# EAGLE design TeamB_BoatAlert (EAGLE 7.4.0)
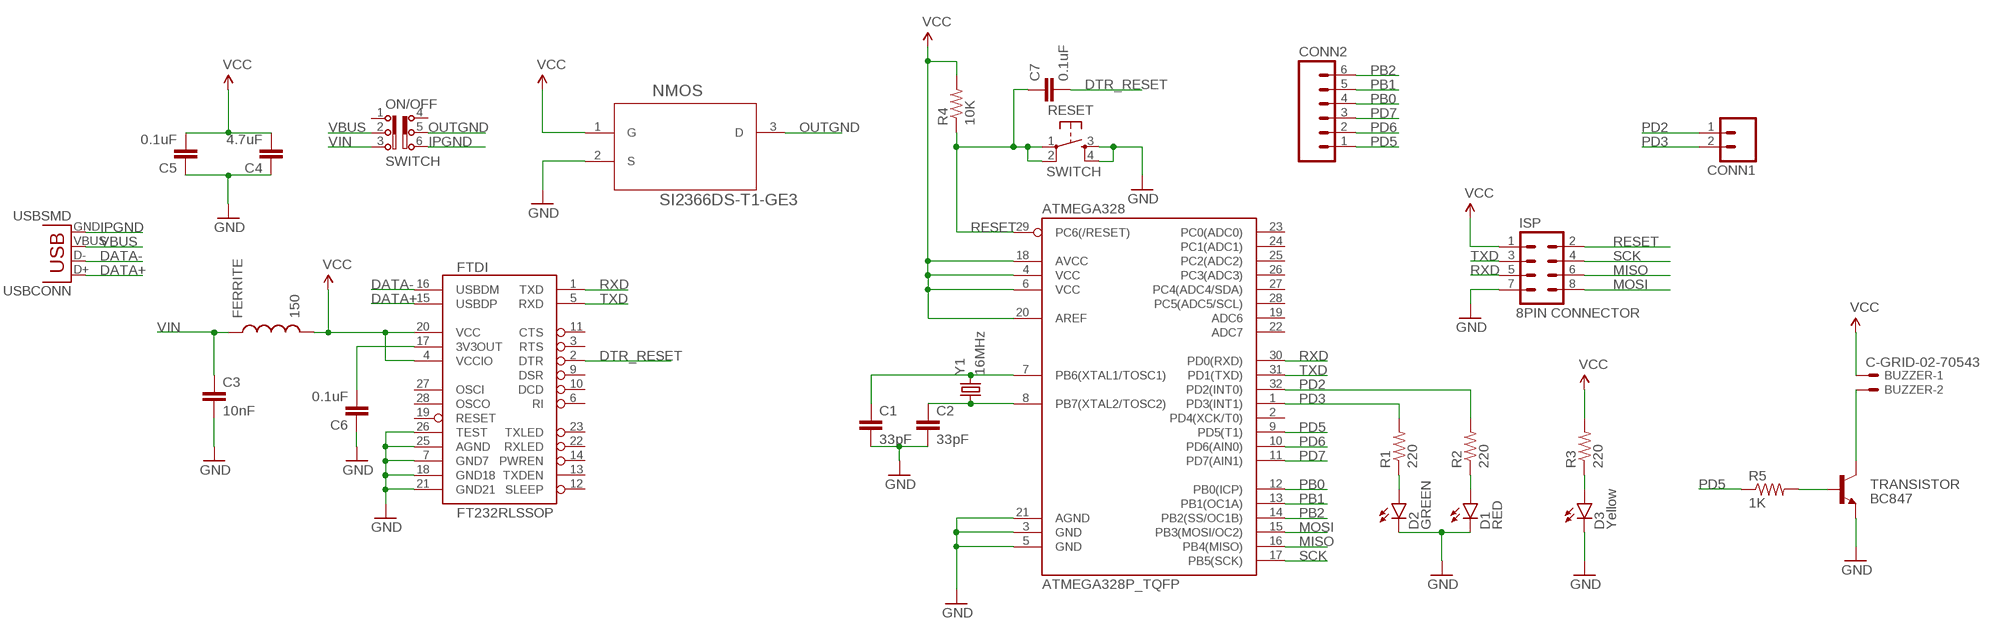
[diagram p0: schematic, sheet 1]

## Parts
ATMEGA328  ATMEGA328P_TQFP  [TQFP32-08]
BUZZER  C-GRID-02-70543  [70543-02]
C1  33pF  33PF-50V-5%-(0603)  [0603-CAP]
C2  33pF  33PF-50V-5%-(0603)  [0603-CAP]
C3  10nF  10NF/10000PF-50V-10%(0603)  [0603-CAP]
C4  4.7uF  4.7UF-6.3V-10%(0603)0603  [0603-CAP]
C5  0.1uF  0.1UF-25V-5%(0603)  [0603-CAP]
C6  0.1uF  0.1UF-25V-5%(0603)  [0603-CAP]
C7  0.1uF  10UF-6.3V-20%(0603)  [0603-CAP]
CONN1  M02LOCK  [1X02_LOCK]
CONN2  M06LONGPADS  [1X06_LONGPADS]
D1  RED  LED-RED0603  [LED-0603]
D2  GREEN  LED-GREEN0603  [LED-0603]
D3  Yellow  LED-YELLOW0603  [LED-0603]
FERRITE  150  INDUCTOR0805  [0805]
FTDI  FT232RLSSOP  [SSOP28DB]
ISP  8PIN CONNECTOR  M04X2  [2X4]
NMOS  SI2366DS-T1-GE3  [SOT95P237X112-3N]
ON/OFF  SWITCH  JS202011SCQN  [JS202011SCQN]
R1  220  0.22OHM-1/4W-1%(0805)  [0805]
R2  220  0.22OHM-1/4W-1%(0805)  [0805]
R3  220  0.22OHM-1/4W-1%(0805)  [0805]
R4  10K  10OHM-1/10W-1%(0603)SMD  [0603-RES]
R5  1K  1KOHM-1/10W-1%(0603)  [0603-RES]
RESET  SWITCH  TACTILE-SWITCH-7914G  [7914G]
TRANSISTOR  BC847  TRANSISTOR_NPNMMBT5088  [SOT23-3]
USBCONN  USBSMD  [USB-MINIB]
Y1  16MHz  CRYSTALSMD  [HC49UP]

## Nets
DATA+: FTDI.15(USBDP) USBCONN.D+
DATA-: FTDI.16(USBDM) USBCONN.D-
DTR_RESET: C7.2 FTDI.2(DTR)
GND: ATMEGA328.3(GND) ATMEGA328.5(GND) ATMEGA328.21(AGND) C1.2 C2.2 C3.2 C4.1 C5.1 C6.1 D1.C D2.C D3.C FTDI.7(GND7) FTDI.18(GND18) FTDI.21(GND21) FTDI.25(AGND) FTDI.26(TEST) ISP.7 NMOS.2(S) RESET.3 RESET.4 TRANSISTOR.2(E)
IPGND: ON/OFF.6 USBCONN.GND
MISO: ATMEGA328.16(PB4(MISO)) ISP.6
MOSI: ATMEGA328.15(PB3(MOSI/OC2)) ISP.8
N$1: ATMEGA328.7(PB6(XTAL1/TOSC1)) C1.1 Y1.2
N$2: ATMEGA328.8(PB7(XTAL2/TOSC2)) C2.1 Y1.1
N$5: D1.A R2.1
N$6: D2.A R1.1
N$7: BUZZER.2 TRANSISTOR.3(C)
N$8: D3.A R3.1
N$9: R5.2 TRANSISTOR.1(B)
N$15: C6.2 FTDI.17(3V3OUT)
OUTGND: NMOS.3(D) ON/OFF.5
PB0: ATMEGA328.12(PB0(ICP)) CONN2.4
PB1: ATMEGA328.13(PB1(OC1A)) CONN2.5
PB2: ATMEGA328.14(PB2(SS/OC1B)) CONN2.6
PD2: ATMEGA328.32(PD2(INT0)) CONN1.1 R2.2
PD3: ATMEGA328.1(PD3(INT1)) CONN1.2 R1.2
PD5: ATMEGA328.9(PD5(T1)) CONN2.1 R5.1
PD6: ATMEGA328.10(PD6(AIN0)) CONN2.2
PD7: ATMEGA328.11(PD7(AIN1)) CONN2.3
RESET: ATMEGA328.29(PC6(/RESET)) C7.1 ISP.2 R4.1 RESET.1 RESET.2
RXD: ATMEGA328.30(PD0(RXD)) FTDI.1(TXD) ISP.5
SCK: ATMEGA328.17(PB5(SCK)) ISP.4
TXD: ATMEGA328.31(PD1(TXD)) FTDI.5(RXD) ISP.3
VBUS: ON/OFF.2 USBCONN.VBUS
VCC: ATMEGA328.4(VCC) ATMEGA328.6(VCC) ATMEGA328.18(AVCC) ATMEGA328.20(AREF) BUZZER.1 C4.2 C5.2 FERRITE.2 FTDI.4(VCCIO) FTDI.20(VCC) ISP.1 NMOS.1(G) R3.2 R4.2
VIN: C3.1 FERRITE.1 ON/OFF.3
Unconnected: ATMEGA328.2(PD4(XCK/T0)) ATMEGA328.19(ADC6) ATMEGA328.22(ADC7) ATMEGA328.23(PC0(ADC0)) ATMEGA328.24(PC1(ADC1)) ATMEGA328.25(PC2(ADC2)) ATMEGA328.26(PC3(ADC3)) ATMEGA328.27(PC4(ADC4/SDA)) ATMEGA328.28(PC5(ADC5/SCL)) FTDI.3(RTS) FTDI.6(RI) FTDI.9(DSR) FTDI.10(DCD) FTDI.11(CTS) FTDI.12(SLEEP) FTDI.13(TXDEN) FTDI.14(PWREN) FTDI.19(RESET) FTDI.22(RXLED) FTDI.23(TXLED) FTDI.27(OSCI) FTDI.28(OSCO) ON/OFF.1 ON/OFF.4

## Library data of the parts
ATMEGA328 = SparkFun-DigitalIC:ATMEGA328P_TQFP; PROD_ID: IC-09069
BUZZER = con-molex:C-GRID-02: CONNECTOR wire to board 2.54 mm (0.100") pitch header; OC_FARNELL: unknown; OC_NEWARK: unknown
C1 C2 = SparkFun-Capacitors:33PF-50V-5%-(0603): CAP-10142; PROD_ID: CAP-10142
C3 = SparkFun-Capacitors:10NF/10000PF-50V-10%(0603): CAP-00867; PROD_ID: CAP-00867
C4 = SparkFun-Capacitors:4.7UF-6.3V-10%(0603): CAP-08280; PROD_ID: CAP-08280
C5 C6 = SparkFun-Capacitors:0.1UF-25V-5%(0603): CAP-08604; PROD_ID: CAP-08604
C7 = SparkFun-Capacitors:10UF-6.3V-20%(0603): CAP-11015; PROD_ID: CAP-11015; VALUE: 10uF
CONN1 = SparkFun-Connectors:M02: Standard 2-pin 0.1" header. Use with - straight break away headers ( PRT-00116) - right angle break away headers (PRT-00553) - swiss pins (PRT-00743) - machine pins (PRT-00117) - female headers (PRT-00115) Molex polarized connector foot print use with: PRT-08233 with associated crimp pins and housings. 2.54_SCREWTERM for use with PRT-10571. 3.5mm Screw Terminal footprints for PRT-08084 5mm Screw Terminal footprints for use with PRT-08432
CONN2 = SparkFun-Connectors:M06: Header 6 Standard 6-pin 0.1" header. Use with straight break away headers (SKU : PRT-00116), right angle break away headers (PRT-00553), swiss pins (PRT-00743), machine pins (PRT-00117), and female headers (PRT-00115). Molex polarized connector foot print use with SKU : PRT-08094 with associated crimp pins and housings. NOTES ON THE VARIANTS LOCK and LOCK_LONGPADS... This footprint was designed to help hold the alignment of a through-hole component (i.e. 6-pin header) while soldering it into place. You may notice that each hole has been shifted either up or down by 0.005 of an inch from it's more standard position (which is a perfectly straight line). This slight alteration caused the pins (the squares in the middle) to touch the edges of the holes. Because they are alternating, it causes a "brace" to hold the component in place. 0.005 has proven to be the perfect amount of "off-center" position when using our standard breakaway headers. Although looks a little odd when you look at the bare footprint, once you have a header in there, the alteration is very hard to notice. Also,if you push a header all the way into place, it is covered up entirely on the bottom side. This idea of altering the position of holes to aid alignment will be further integrated into the Sparkfun Library for other footprints. It can help hold any component with 3 or more connection pins.
D1 = SparkFun-LED:LED-RED: Assorted Red LEDs LilyPad 1206- DIO-09912 1206- DIO-00809 0603- DIO-00819 "SMART" means more efficient and expensive; PROD_ID: DIO-00819
D2 = SparkFun-LED:LED-GREEN: Various green LEDs Green LEDs used in SFE Production 0603- DIO-00821 LARGE- DIO-00862 LILYPAD- DIO-09910; PROD_ID: DIO-00821
D3 = SparkFun-LED:LED-YELLOW: Yellow SMD LEDs LilyPad 1206- DIO-09909 0603- DIO-09003 "SMART" means more efficient and expensive; PROD_ID: DIO-09003
FERRITE = SparkFun-Passives:INDUCTOR: Inductors Basic Inductor/Choke - 0603 and 1206. Footprints are not proven and vary greatly between part numbers. INDUCTOR POWER 3.3UH 4.0A SMD 0.197" L x 0.197" W x 0.177" H (5.00mm x 5.00mm x 4.50mm)
FTDI = SparkFun-DigitalIC:FT232RL: USB UART FT232RL 4th Generation USB UART (USB <-> Serial) Controller. Spark Fun Electronics SKU : COM-00650 Production SKU IC-00870; PROD_ID: IC-00870
ISP = SparkFun-Connectors:M04X2: .1" header, two rows of four.
NMOS = Vishay_By_element14_Batch_1:SI2366DS-T1-GE3: N-Channel 30 V (D-S) MOSFET; MPN: SI2366DS-T1-GE3; OC_FARNELL: 2056680; OC_NEWARK: 64T4057; PACKAGE: SOT-23-3; SUPPLIER: VISHAY SILICONIX
ON/OFF = switch-ck:JS202011SCQN: DPDT SLIDE SWITCH
R1-R3 = SparkFun-Resistors:0.22OHM-1/4W-1%(0805): RES-09883; PROD_ID: RES-09883; VALUE: 0.22
R4 = SparkFun-Resistors:10OHM-1/10W-1%(0603): RES-12581; PROD_ID: RES-12581; VALUE: 10
R5 = SparkFun-Resistors:1KOHM-1/10W-1%(0603): RES-07856; PROD_ID: RES-07856
RESET = GeekAmmo:TACTILE-SWITCH: Tactile Switch 4 Pins, SPST NO
TRANSISTOR = SparkFun-DiscreteSemi:TRANSISTOR_NPN: Generic NPN BJT MMBT2222A - TRANS-08049 (SOT-23, 1A 40V) MPSA42 - TRANS-09116 (SOT-23, 500mA 300V) MMBT5088LT1G - TRANS-11160 (SOT-23, 50 mA 30V) BC547 - COM-08928 <http://www.sparkfun.com/products/8928> (TO-92 45V 100mA) (1.Collector 2.Base 3.Emitter) 2N3904 - COM-00521 <http://www.sparkfun.com/products/521> (TO-92 40V 200mA) (1.Emitter 2.Base 3.Collector) P2N2222A - COM-12852 <http://www.sparkfun.com/products/12852> (TO-92 40V 600mA) (1.Collector 2.Base 3.Emitter); PROD_ID: TRANS-11160; VALUE: MMBT5088
USBCONN = SparkFun-Connectors:USB: USB Connectors USB-B-PTH is fully proven SKU : PRT-00139/CONN-08278 USB-miniB is fully proven SKU : PRT-00587 USB-A-PCB is untested. USB-A-H is throughly reviewed, but untested. Spark Fun Electronics SKU : PRT-00437 USB-B-SMT is throughly reviewed, but untested. Needs silkscreen touching up. USB-A-S has not been used/tested USB-MB-H has not been used/tested USB-MICROB has been used. CONN-09505; PROD_ID: CONN-08193
Y1 = SparkFun-FreqCtrl:CRYSTAL: Various standard crystals. Proven footprints.

## Board
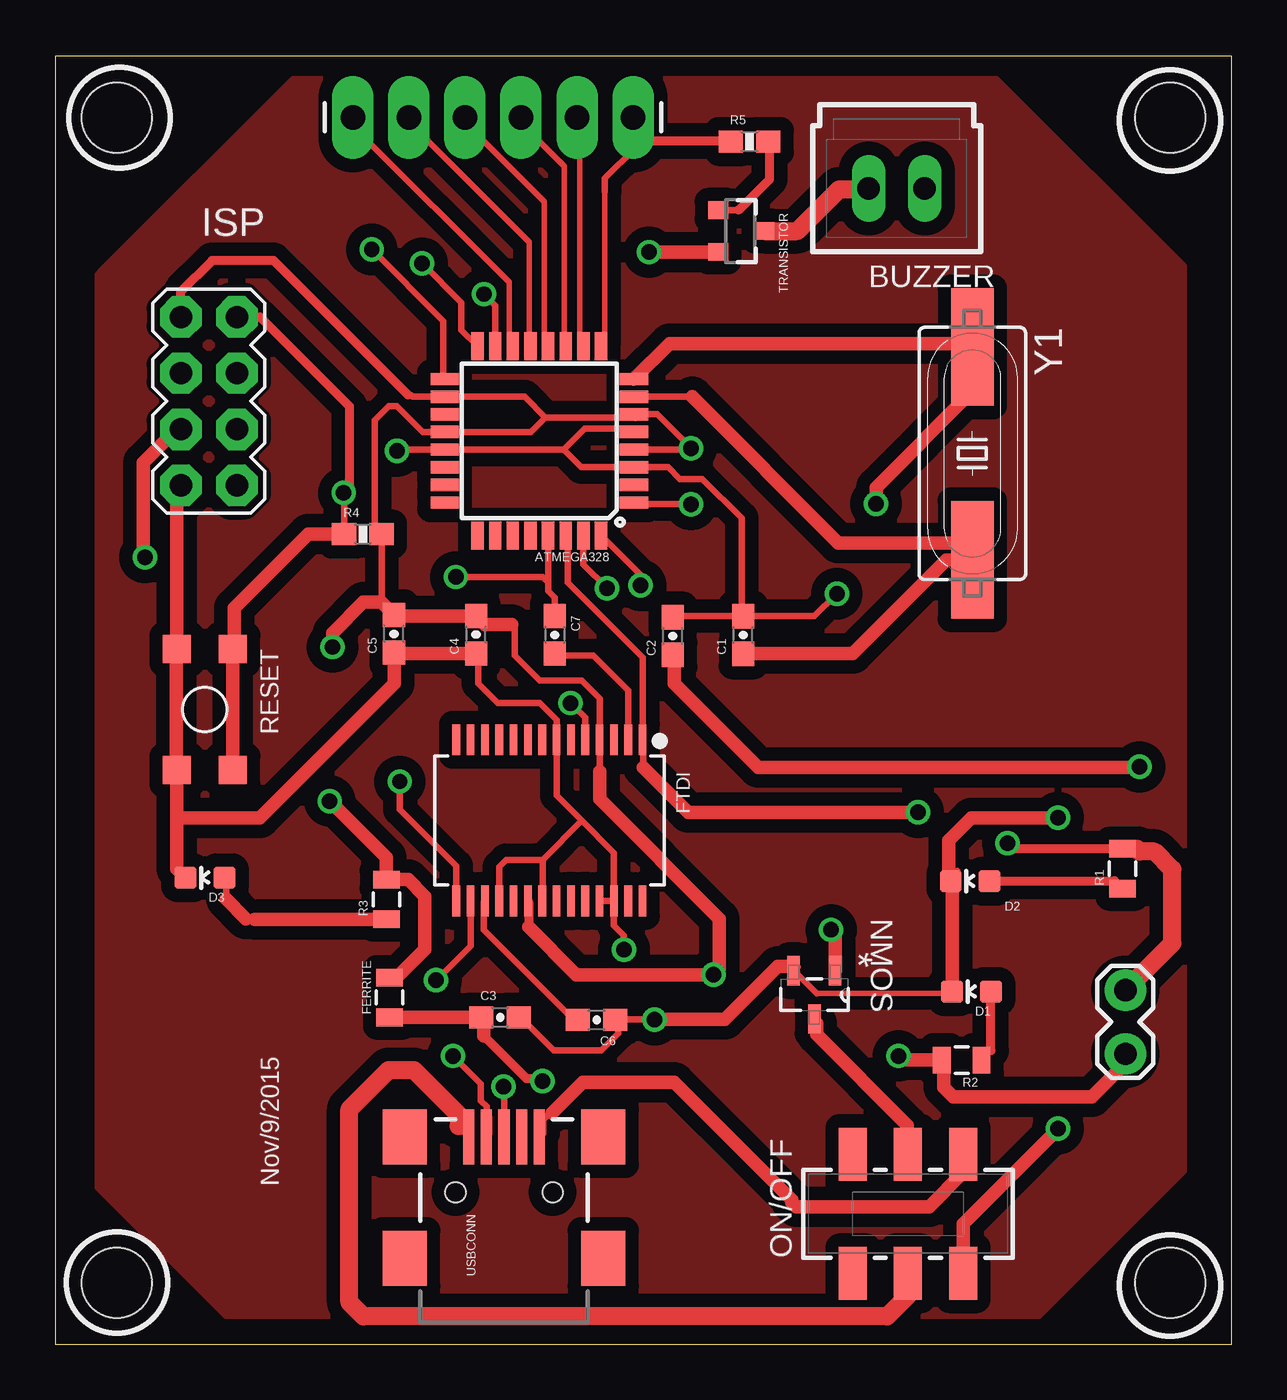
[diagram p1: board, top side]
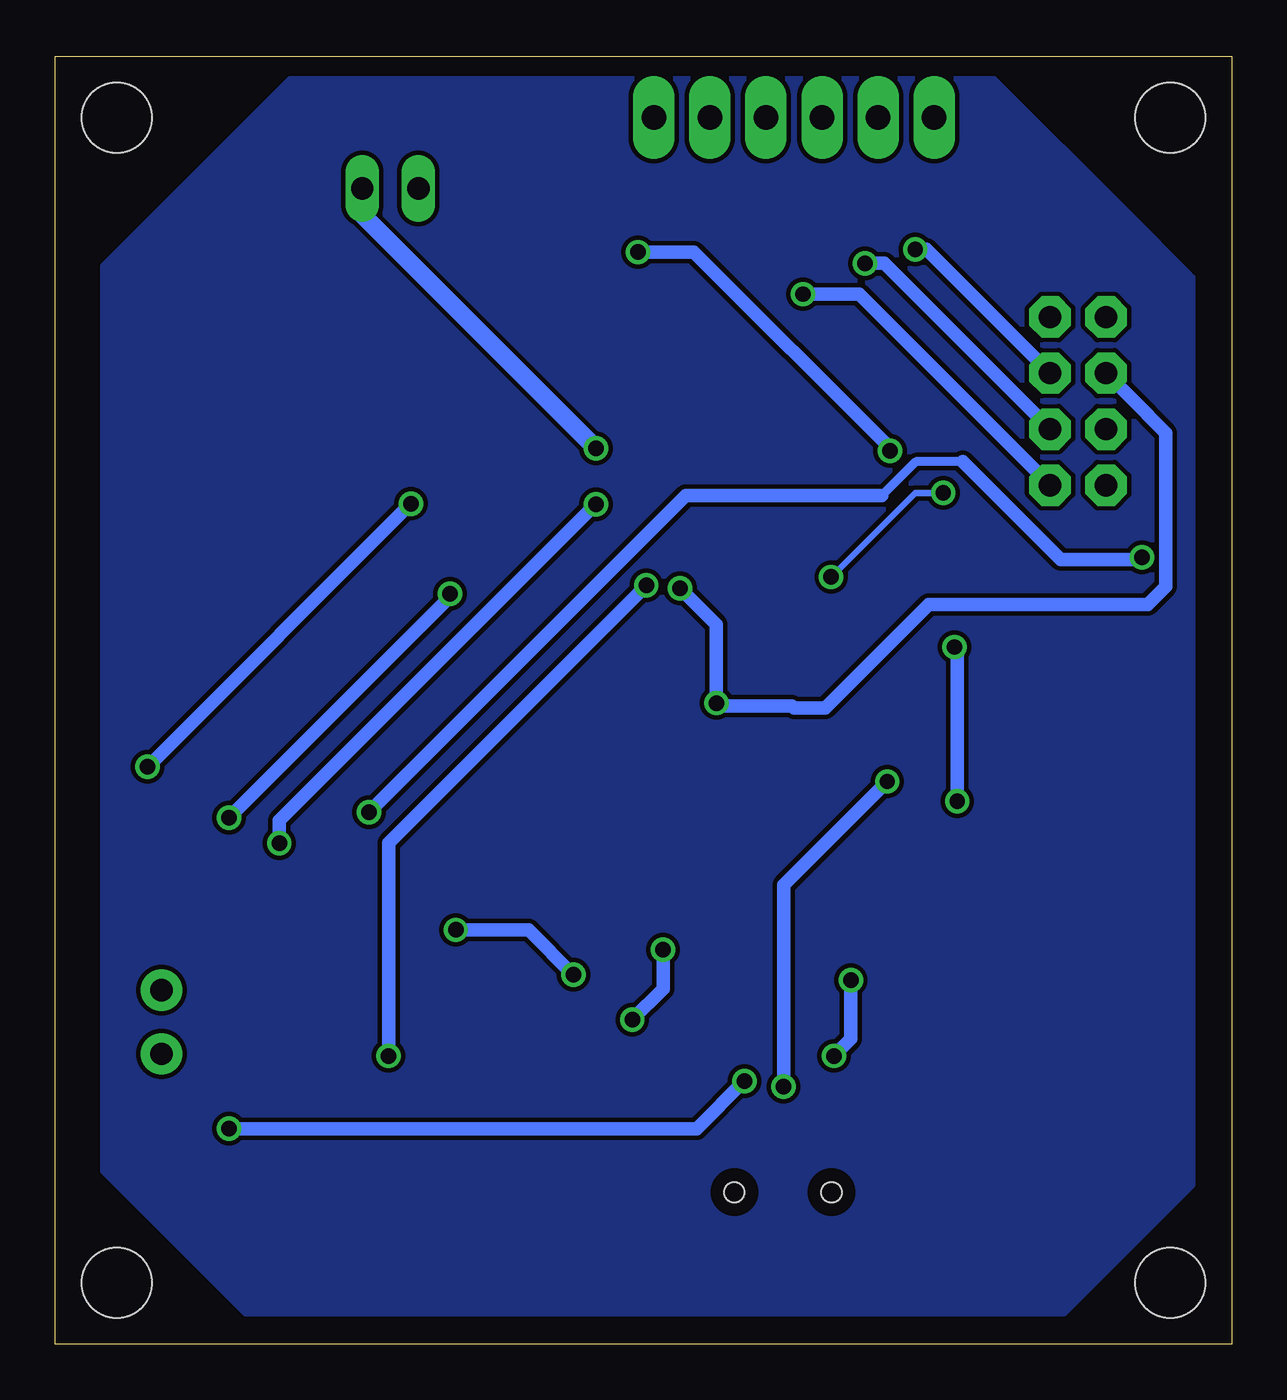
[diagram p2: board, bottom side, seen from below]

Size 53.34 x 58.42 mm. Coordinates in mm from the lower left corner, seen from the top.
Outline: 0,0 53.34,0 53.34,58.42 0,58.42 0,0
Copper layers (1*16): Top 0.035mm / dielectric 1.5mm / Bottom 0.035mm
Design rules "default *": minimum track width 10mil, minimum drill 24mil, track to track 8mil, track to pad 8mil, pad to pad 8mil, via to via 8mil, smd to smd 8mil, copper to edge 25mil, drill to drill 8mil, minimum pad ring 10mil, minimum via ring 8mil, stop-mask expansion 4mil, vias tented up to drill 0mil, thermal gap 10mil
Holes 3.17 mm at 2.79,2.79 50.55,2.79 2.79,55.63 50.55,55.63

### Footprints (pad centres in the part's own frame; a part is rotated, then mirrored left to right if it is on the bottom)
TQFP32-08 = smd 1.27 x 0.559: 1 -4.293,2.8; 2 -4.293,2; 3 -4.293,1.2; 4 -4.293,0.4; 5 -4.293,-0.4; 6 -4.293,-1.2; 7 -4.293,-2; 8 -4.293,-2.8; 17 4.293,-2.8; 18 4.293,-2; 19 4.293,-1.2; 20 4.293,-0.4; 21 4.293,0.4; 22 4.293,1.2; 23 4.293,2; 24 4.293,2.8 | smd 0.559 x 1.27: 9 -2.8,-4.293; 10 -2,-4.293; 11 -1.2,-4.293; 12 -0.4,-4.293; 13 0.4,-4.293; 14 1.2,-4.293; 15 2,-4.293; 16 2.8,-4.293; 25 2.8,4.293; 26 2,4.293; 27 1.2,4.293; 28 0.4,4.293; 29 -0.4,4.293; 30 -1.2,4.293; 31 -2,4.293; 32 -2.8,4.293
70543-02 = drill 1.016 long: 1 -1.27,0; 2 1.27,0
0603-CAP = smd 1.1 x 1: 1 -0.85,0; 2 0.85,0
1X02_LOCK = drill 1.016 pad 1.88: 1 -0.178,0; 2 2.718,0
1X06_LONGPADS = drill 1.118 pad 1.88 long: 1 0,0; 2 2.54,0; 3 5.08,0; 4 7.62,0; 5 10.16,0; 6 12.7,0
LED-0603 = smd 1 x 1: A 0,-0.877; C 0,0.877
0805 = smd 0.8 x 1.2: 1 -0.9,0; 2 0.9,0
SSOP28DB = smd 0.348 x 1.397: 1 -4.225,-3.656; 2 -3.575,-3.656; 3 -2.925,-3.656; 4 -2.275,-3.656; 5 -1.625,-3.656; 6 -0.975,-3.656; 7 -0.325,-3.656; 8 0.325,-3.656; 9 0.975,-3.656; 10 1.625,-3.656; 11 2.275,-3.656; 12 2.925,-3.656; 13 3.575,-3.656; 14 4.225,-3.656; 15 4.225,3.656; 16 3.575,3.656; 17 2.925,3.656; 18 2.275,3.656; 19 1.625,3.656; 20 0.975,3.656; 21 0.325,3.656; 22 -0.325,3.656; 23 -0.975,3.656; 24 -1.625,3.656; 25 -2.275,3.656; 26 -2.925,3.656; 27 -3.575,3.656; 28 -4.225,3.656
2X4 = drill 1.016 pad 1.88 octagon: 1 -3.81,-1.27; 2 -3.81,1.27; 3 -1.27,-1.27; 4 -1.27,1.27; 5 1.27,-1.27; 6 1.27,1.27; 7 3.81,-1.27; 8 3.81,1.27
SOT95P237X112-3N = smd 1.321 x 0.559: 1 -1.092,0.94; 2 -1.092,-0.94; 3 1.092,0
JS202011SCQN = smd 1.27 x 2.4: 1 -2.5,-2.7; 2 0,-2.7; 3 2.5,-2.7; 4 -2.5,2.7; 5 0,2.7; 6 2.5,2.7
0603-RES = smd 1.1 x 1: 1 -0.85,0; 2 0.85,0
7914G = smd 1.27 x 1.27: 1 0,0; 2 0,5.486; 3 2.54,0; 4 2.54,5.486
SOT23-3 = smd 0.8 x 0.9: 1 -0.95,-1; 2 0.95,-1; 3 0,1.1
USB-MINIB = smd 2.5 x 0.5: D+ 2.5,0; D- 2.5,0.8; GND 2.5,-1.6; ID 2.5,-0.8; VBUS 2.5,1.6 | smd 2.5 x 2: MTN1 -3,4.5; MTN2 2.5,4.5; MTN3 -3,-4.5; MTN4 2.5,-4.5 | hole 0.9: 0,2.2; 0,-2.2
HC49UP = smd 5.334 x 1.93: 1 -4.826,0; 2 4.826,0

### Placement (x,y rotation side)
ATMEGA328  21.95,40.97 180 top
BUZZER  38.15,52.41 180 top
C1  31.19,32.17 90 top
C2  28,32.12 90 top
C3  20.17,14.83 0 top
C4  19.08,32.18 90 top
C5  15.36,32.22 90 top
C6  24.54,14.71 180 top
C7  22.64,32.17 270 top
CONN1  48.51,13.35 90 top
CONN2  26.2,55.64 180 top
D1  41.54,15.99 90 top
D2  41.48,21.01 90 top
D3  6.79,21.16 90 top
FERRITE  15.16,15.73 90 top
FTDI  22.4,23.76 180 top
ISP  6.97,42.77 270 top
NMOS  34.42,15.85 270 top
ON/OFF  38.66,5.92 0 top
R1  48.38,21.57 90 top
R2  41.09,12.89 180 top
R3  15.01,20.18 90 top
R4  13.95,36.74 0 top
R5  31.48,54.54 0 top
RESET  8.06,31.52 180 top
TRANSISTOR  31.05,50.48 270 top
USBCONN  20.35,6.9 90 top
Y1  41.58,40.4 270 top

### Tracks (layer width: path | path; a pad name or v marks a point on that pad's centre or on a via)
DATA+  (via drill 0.7)
  Top 0.305: USBCONN.D+ 20.35,11.66 v20.32,11.68 | v15.62,25.53 15.62,24.26 18.18,21.7 FTDI.15
  Bottom 0.61: v20.32,11.68 20.32,20.83 v15.62,25.53
DATA-  (via drill 0.7)
  Top 0.305: FTDI.16 18.83,18.07 v17.27,16.51 | v18.03,13.08 19.3,11.81 19.3,11.05 19.56,10.79 19.56,10.41 19.68,10.29 19.68,9.54 USBCONN.D-
  Bottom 0.61: v17.27,16.51 17.27,13.84 v18.03,13.08
DTR_RESET
  Top 0.305: FTDI.2 25.98,29.65 24.38,31.24 22.73,31.24 C7.2
GND  (via drill 0.7)
  Top 0.254: 26.06,41.53 ATMEGA328.5 | 5.49,31.47 RESET.3 | 5.49,26.21 RESET.4 | 34.52,15.93 40.46,15.93 D1.C | 33.6,16.84 NMOS.2
  Top 0.305: 33.6,16.84 34.52,15.93 | 23.05,40.57 24,41.53 26.09,41.53 ATMEGA328.5 | 5.52,38.78 ISP.7 | 5.52,21.55 D3.C | C4.1 19.18,31.24 19.18,29.97 20.07,29.08 21.97,29.08 22.73,28.32 FTDI.7 22.73,24.9 23.88,23.75 | 33.66,17.12 NMOS.2 33.28,17.14 | 15.4,31.33 C5.1 | C3.2 21.11,14.83 22.61,13.34 24.77,13.34 25.53,14.1 25.53,14.57 C6.1 25.41,14.73 v27.18,14.73 | 5.9,23.88 5.52,23.5 | 23.05,40.57 23.85,39.77 ATMEGA328.3 27.79,39.77 28.32,39.24 29.34,39.24 31.11,37.47 31.11,33.1 C1.2 | v15.49,40.51 15.55,40.57 ATMEGA328.21 23.05,40.57 | TRANSISTOR.2 | C2.2 28.05,33.02 C1.2 | 40.66,21.23 40.89,21.46 40.89,21.3 D2.C 40.51,21.09 | C1.2 34.42,33.02 v35.43,34.04 | FTDI.18 20.13,21.65 20.45,21.97 22.1,21.97 | 22.1,21.97 22.1,20.13 FTDI.21 | v25.78,17.91 25.78,18.54 25.33,18.99 FTDI.26 | 22.1,21.97 23.88,23.75 | FTDI.26 25.33,22.3 23.88,23.75 | FTDI.25 FTDI.26
  Top 0.61: 5.49,26.21 5.49,31.47 | RESET.3 5.52,38.78 | RESET.4 5.52,23.5 5.52,21.55 | C4.1 15.4,31.33 | v27.18,14.73 30.35,14.73 32.77,17.14 33.28,17.14 | C5.1 15.36,29.97 9.27,23.88 5.9,23.88 | v26.92,49.53 TRANSISTOR.2 | D1.C 40.66,21.23 | v45.47,23.88 41.53,23.88 40.51,22.86 40.51,21.09
  Bottom 0.305: v15.49,40.51 15.49,40.64 | v35.43,34.04 35.43,33.91
  Bottom 0.61: v25.78,17.91 25.78,16.13 v27.18,14.73 | 15.49,40.64 24.38,49.53 v26.92,49.53 | 35.43,33.91 v45.47,23.88
IPGND
  Top 0.254: 41.15,8.61 ON/OFF.6
  Top 0.305: 22.53,10.49 22.43,10.49 22.12,10.19 22.12,9.58 USBCONN.GND
  Top 0.61: 41.15,8.61 41.15,7.77 39.62,6.25 33.6,6.25 33.4,6.45 33.4,6.55 28.07,11.89 23.93,11.89 22.53,10.49
MISO  (via drill 0.7)
  Top 0.305: v16.64,49.02 18.41,47.24 18.41,46 ATMEGA328.16
  Bottom 0.61: v16.64,49.02 15.76,49.02 ISP.6
MOSI  (via drill 0.7)
  Top 0.305: ATMEGA328.15 19.95,47.11 v19.43,47.62
  Bottom 0.61: v19.43,47.62 16.9,47.62 ISP.8
N$1
  Top 0.305: 41.56,35.56 Y1.2 41.4,35.75 41.4,36.07 | 41.15,36.2 41.4,36.45 41.4,36.07 | ATMEGA328.7 28.88,42.97 | 41.12,36.35 41.4,36.07
  Top 0.61: C1.1 36.15,31.32 40.39,35.56 41.56,35.56 | 28.88,42.97 35.51,36.35 41.12,36.35
N$2  (via drill 0.7)
  Top 0.305: 41.53,43.18 41.53,43.79 | 41.53,43.79 41.53,44.45 41.66,44.58 41.66,45.15 Y1.1 | 28.07,31.2 C2.1 | 41.51,43.77 41.53,43.79 | 49.12,26.16 v49.15,26.19 | ATMEGA328.8 26.32,43.77
  Top 0.61: 49.12,26.16 31.88,26.16 28.07,29.97 28.07,31.2 | v37.21,38.12 37.21,38.86 41.53,43.18 | Y1.1 41.42,45.39 27.86,45.39 ATMEGA328.8
  Bottom 0.61: v49.15,26.19 v37.21,38.12
N$5
  Top 0.254: R2.1 42.41,13.32
  Top 0.406: 42.41,13.32 D1.A
N$6
  Top 0.254: 48.03,21.02 R1.1
  Top 0.406: D2.A 48.03,21.02
N$7
  Top 0.305: 36.79,52.32 BUZZER.2
  Top 0.813: TRANSISTOR.3 33.64,50.48 35.53,52.38 36.84,52.38 BUZZER.2
N$8
  Top 0.305: 9.04,19.28 9.02,19.3 8.64,19.3 | 7.75,20.19 7.75,21.08 D3.A
  Top 0.61: R3.1 9.04,19.28 | 8.64,19.3 7.75,20.19
N$9
  Top 0.305: TRANSISTOR.1 30.99,51.43 | 32.38,54.49 R5.2
  Top 0.406: 30.99,51.43 32.38,52.83 32.38,54.49
N$12
  pour Top (isolate 0.61): 2.03,48.64 10.79,57.4 42.67,57.4 51.18,48.9 51.18,7.87 44.58,1.27 7.75,1.27 1.91,7.11 1.91,48.51
N$15
  Top 0.305: C6.2 23.52,14.71 19.43,18.8 19.43,20.06 FTDI.17
N$20
  pour Bottom: 1.91,48.51 4.7,51.31 10.79,57.4 42.67,57.4 51.18,48.9 51.18,7.87 44.7,1.4 7.62,1.4 1.78,7.24 1.78,48.39
OUTGND
  Top 0.254: 34.52,14.55 NMOS.3 | 38.63,8.84 ON/OFF.5
  Top 0.61: 34.52,14.55 34.52,14.05 38.63,9.93 ON/OFF.5
PB0
  Top 0.254: ATMEGA328.12 22.17,45.41 22.17,51.82 18.52,55.47 CONN2.4
PB1
  Top 0.254: ATMEGA328.13 21.49,45.41 21.49,49.99 16,55.47 CONN2.5
PB2
  Top 0.254: ATMEGA328.14 20.57,45.41 20.57,48.16 13.72,55.02 13.72,55.47 CONN2.6
PD2  (via drill 0.7)
  Top 0.254: 24.92,36.5 ATMEGA328.32 | R2.2 40.26,12.83
  Top 0.305: 38.41,12.89 v38.23,13.08 | v26.54,34.42 26.54,34.88 ATMEGA328.32
  Top 0.61: 38.41,12.89 R2.2 40.28,12.8 40.28,11.66 40.72,11.23 46.99,11.23 48.51,12.75 CONN1.1
  Bottom 0.254: 48.51,13.56 CONN1.1
  Bottom 0.61: v38.23,13.08 38.23,22.73 v26.54,34.42
PD3  (via drill 0.7)
  Top 0.254: 49.03,22.47 R1.2
  Top 0.305: 43.44,22.47 v43.18,22.73 | v28.83,38.1 26.31,38.1 ATMEGA328.1
  Top 0.406: R1.2 43.44,22.47
  Top 0.813: CONN1.2 48.53,16.07 50.65,18.19 50.65,21.54 49.84,22.35 49.15,22.35 49.03,22.47
  Bottom 0.61: v43.18,22.73 43.18,23.75 v28.83,38.1
PD5
  Top 0.254: 30.4,54.56 R5.1 | 26.29,55.47 CONN2.1 | 24.92,52.27 24.92,45.41 ATMEGA328.9
  Top 0.305: 24.92,52.27 24.92,52.88 26.26,54.23 26.26,54.69 | 26.26,54.69 26.26,55.58 CONN2.1 | 26.39,54.56 26.26,54.69
  Top 0.406: 30.4,54.56 26.39,54.56
PD6
  Top 0.254: ATMEGA328.10 23.77,45.41 23.77,55.47 CONN2.2
PD7
  Top 0.254: ATMEGA328.11 23.09,45.41 23.09,53.42 21.03,55.47 CONN2.3
RESET  (via drill 0.7)
  Top 0.305: C7.1 22.64,33.87 22.35,34.16 22.35,34.54 | 22.35,34.54 ATMEGA328.29 | 8.13,31.59 RESET.1 | R4.1 13.1,38.59 v13.08,38.61 13.34,38.86 | v18.16,34.8 22.1,34.8 22.35,34.54
  Top 0.406: ISP.2 9.3,46.58 13.34,42.55 13.34,38.86
  Top 0.61: RESET.2 RESET.1 | R4.1 11.46,36.74 8.13,33.4 8.13,31.59
  Bottom 0.305: v13.08,38.61 14.35,38.61 v18.16,34.8
RXD  (via drill 0.7)
  Top 0.305: ATMEGA328.30 23.24,36.59 23.24,34.54 26.63,31.16 FTDI.1 26.67,27.38 26.67,26.16 | ISP.5 5.51,41.5 | 3.99,35.76 v4.06,35.69
  Top 0.61: v39.12,24.13 28.7,24.13 26.67,26.16 | 5.51,41.5 3.99,39.98 3.99,35.76
  Bottom 0.305: 4.17,35.59 v4.06,35.69
  Bottom 0.406: 15.88,38.48 14.33,40.03 12.19,40.03
  Bottom 0.61: 15.88,38.48 24.77,38.48 v39.12,24.13 | 12.19,40.03 7.75,35.59 4.17,35.59
SCK  (via drill 0.7)
  Top 0.254: 17.6,43.81 ATMEGA328.17 | 8.46,44.04 ISP.4
  Top 0.305: 17.6,43.81 17.6,46.41 v14.35,49.66
  Bottom 0.61: v14.35,49.66 13.85,49.66 ISP.4
TXD  (via drill 0.7)
  Top 0.305: FTDI.5 24.03,28.42 v23.37,29.08 | v25.02,34.29 23.95,35.36 ATMEGA328.31
  Bottom 0.305: 23.24,28.96 v23.37,29.08 | 3.81,42.16 3.81,42.14 | 19.84,28.85 19.94,28.96
  Bottom 0.61: v23.37,29.08 23.37,32.64 v25.02,34.29 | 19.94,28.96 23.24,28.96 | 3.81,42.16 ISP.3 | 3.81,42.14 3,41.33 3,34.37 3.81,33.55 13.74,33.55 18.44,28.85 19.84,28.85
VBUS
  Top 0.305: 18.29,9.91 18.29,9.86 USBCONN.VBUS
  Top 0.813: ON/OFF.2 38.66,2.21 37.72,1.27 13.97,1.27 13.34,1.91 13.34,10.67 15.11,12.45 16.26,12.45 18.29,10.41 18.29,9.91
VCC  (via drill 0.7)
  Top 0.254: 26.29,41.99 ATMEGA328.6
  Top 0.305: 22.23,42.04 21.56,41.37 ATMEGA328.20 16.66,41.37 15.49,42.55 15.11,42.55 14.48,41.91 14.48,37.06 R4.2 14.8,33.63 14.78,33.66 | 22.23,42.04 26.1,42.04 ATMEGA328.6 27.3,42.17 v28.83,40.64 28.76,40.57 ATMEGA328.4 | 22.23,42.04 21.29,42.97 ATMEGA328.18 16.21,42.97 16.13,43.05 16,43.05 | 20.7,32.64 20.83,32.51 20.83,31.24 21.97,30.1 23.88,30.1 24.68,29.3 FTDI.4 24.68,25.98 24.69,25.98 | 19.47,32.64 C4.2 | 15.4,33.03 C5.2 | 21.46,20.07 FTDI.20 | 30.1,17.02 v29.84,16.76 | FERRITE.2 15.49,16.63 | R3.2
  Top 0.406: 16,43.05 9.91,49.15 7.11,49.15 5.7,47.73 ISP.1 | 21.46,20.07 21.46,18.92
  Top 0.61: 20.7,32.64 19.47,32.64 | C4.2 15.4,33.03 | NMOS.1 35.36,18.62 v35.18,18.8 | v29.84,16.76 23.62,16.76 21.46,18.92 | 30.1,17.02 30.1,19.3 24.68,24.72 24.69,24.72 24.69,25.98 | 14.8,33.63 C5.2 | R3.2 15.01,22.07 v12.45,24.64 | v12.57,31.62 12.57,32.26 13.97,33.66 14.78,33.66 | 15.49,16.63 16.76,17.91 16.76,20.32 16,21.08 R3.2
  Bottom 0.305: 12.45,31.5 v12.57,31.62
  Bottom 0.61: v35.18,18.8 31.88,18.8 v29.84,16.76 | v12.45,24.64 12.45,31.5
  Bottom 0.813: BUZZER.1 39.42,51.23 v28.83,40.64
VIN  (via drill 0.7)
  Top 0.305: v22.1,11.94 22.1,12.05 | FERRITE.1
  Top 0.406: 22.1,12.05 21.38,12.05 19.43,13.99
  Top 0.61: ON/OFF.3 41.16,5.47 v45.47,9.78 | FERRITE.1 C3.1 19.43,14.72 19.43,13.99
  Bottom 0.61: v45.47,9.78 24.26,9.78 v22.1,11.94

### Text on the board
tPlace: Nov/9/2015
tValues: AutoPirates-RevA
tTest: 5 | 6 | 7 | 8 | 9 | 10 | RESET | VCC | TXD | SCK | RXD | MISO | GND | MOSI | PIN D3 | Power | PIN D2 | 3 | 2